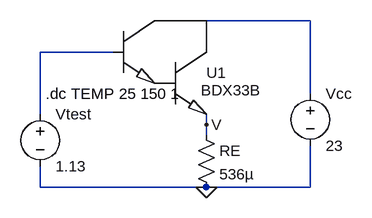
[diagram p0: schematic Draft1.asc]
Draft1.asc, the LTspice schematic file:
Version 4
SHEET 1 880 680
WIRE 368 16 208 16
WIRE 64 64 -48 64
WIRE 368 128 368 16
WIRE -48 160 -48 64
WIRE 208 176 208 160
WIRE 208 192 208 176
WIRE -48 272 -48 240
WIRE 208 272 -48 272
WIRE 368 272 368 208
WIRE 368 272 208 272
FLAG 208 272 0
FLAG 208 176 V
SYMBOL voltage 368 112 R0
WINDOW 123 0 0 Left 0
WINDOW 39 0 0 Left 0
SYMATTR InstName Vcc
SYMATTR Value 23
SYMBOL myLib\\BDX33B 80 16 R0
SYMATTR InstName U1
SYMBOL res 192 176 R0
SYMATTR InstName RE
SYMATTR Value 536µ
SYMBOL voltage -48 144 R0
WINDOW 123 0 0 Left 0
WINDOW 39 0 0 Left 0
SYMATTR InstName Vtest
SYMATTR Value 1.13
TEXT -40 128 Left 0 !.dc TEMP 25 150 1

The netlist it stands for:
* Draft1.asc
Vcc N001 0 23
XU1 N001 N002 V BDX33B  ; pins C B E
RE V 0 536µ
Vtest N002 0 1.13
.dc TEMP 25 150 1
.lib myLib\BDX33B.lib
.backanno
.end